# Altium schematic sheet Sheet1.SchDoc
size A4; SheetNumber: 1; SheetTotal: 3
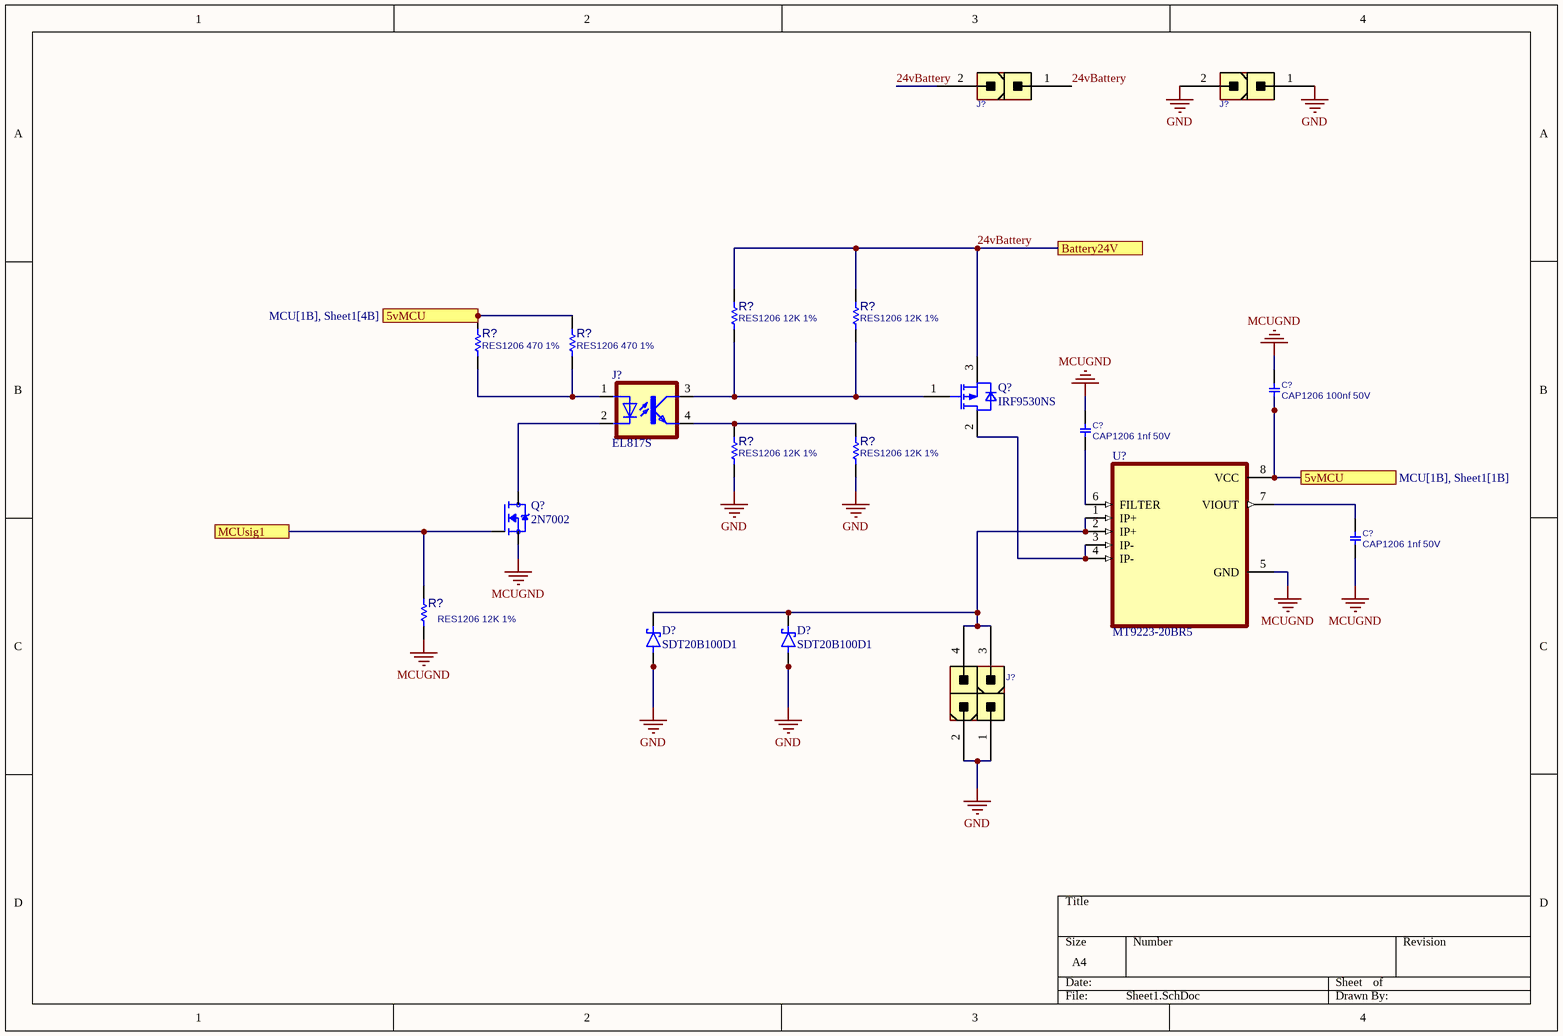
[diagram p0: Sheet1.SchDoc]

## Parts
(Parts that share a designator on the sheet are numbered #1, #2 ... from top to bottom, then left to right.)
C?#1  CAP1206 100nf 50V  [C1206]
C?#2  CAP1206 1nf 50V  [C1206]
C?#3  CAP1206 1nf 50V  [C1206]
D?#1  SDT20B100D1  [DPAK229P990X238-3N]
D?#2  SDT20B100D1  [DPAK229P990X238-3N]
J?#1  CONN_ATXPWR_2  [ATXPWR_2]  (value not drawn)
J?#2  CONN_ATXPWR_2  [ATXPWR_2]  (value not drawn)
J?#3  EL817S  [SOIC254P1030X460-4N]
J?#4  CONN_ATXPWR_4  [ATXPWR_4]  (value not drawn)
Q?#1  IRF9530NS  [TO254P1528X508-4_3N-V1]
Q?#2  2N7002  [SOT95P240X111-3N]
R?#1  RES1206 12K 1%  [R1206]
R?#2  RES1206 12K 1%  [R1206]
R?#3  RES1206 470 1%  [R1206]
R?#4  RES1206 470 1%  [R1206]
R?#5  RES1206 12K 1%  [R1206]
R?#6  RES1206 12K 1%  [R1206]
R?#7  RES1206 12K 1%  [R1206]
U?  MT9223-20BR5  [SOIC127P600X175-8N]

## Ports
5vMCU (see MCU[1B], Sheet1[1B]), 5vMCU (see MCU[1B], Sheet1[4B]), Battery24V, MCUsig1

## Nets
GND: D?#1.1(A) D?#1.3(A__1) D?#2.1(A) D?#2.3(A__1) J?#2.1 J?#2.2 J?#4.1 J?#4.2 R?#5.2 R?#6.2
MCUGND: C?#1.1 C?#2.2 C?#3.2 Q?#2.2(S) R?#7.2 U?.5(GND)
5vMCU: C?#1.2 R?#3.2 R?#4.2 U?.8(VCC) ; port 5vMCU
24vBattery: J?#1.1 J?#1.2 Q?#1.3(SOURCE) R?#1.1 R?#2.1 ; port Battery24V
MCUsig1: Q?#2.1(G) R?#7.1 ; port MCUsig1
NetC?#2_1: C?#2.1 U?.6(FILTER)
NetC?#3_1: C?#3.1 U?.7(VIOUT)
NetD?#1_4: D?#1.4(K) D?#2.4(K) J?#4.3 J?#4.4 U?.1(IP+) U?.2(IP+)
NetJ?#3_1: J?#3.1(A) R?#3.1 R?#4.1
NetJ?#3_2: J?#3.2(C) Q?#2.3(D)
NetJ?#3_3: J?#3.3(COL) Q?#1.1(GATE) R?#1.2 R?#2.2
NetJ?#3_4: J?#3.4(EMIT) R?#5.1 R?#6.1
NetQ?#1_2: Q?#1.2(DRAIN) U?.3(IP-) U?.4(IP-)

## Library data of the parts
C?#1-C?#3 = CAP_SMD_MLCC_1206: CAP, MLCC; PARAM: -, -%; MANF_P#: MANF_PART#; PARAM2: -V; PRICE: 100= 1$; MANF: -; ASSEMBLY: ASSEMBLY
D?#1 D?#2 = MBRD835L: Diode Schottky 35 V 8A Surface Mount DPAK; MF: ON Semiconductor; SnapEDA_Link: https://www.snapeda.com/parts/MBRD835L/Onsemi/view-part/?ref=snap; Package: TO-252-3 MICROSS/On Semiconductor; Value: *; MP: MBRD835L; Check_prices: https://www.snapeda.com/parts/MBRD835L/Onsemi/view-part/?ref=eda
J?#1 J?#2 = CONN_ATXPWR_2: CONN, ATX POWER, 2 P; MANF: Molex; MANF_P#: 39281023; VALUE: CONN_ATXPWR_2; MountType: THD; PACKAGE: ATXPWR-2pin; Part Type: Conn.
J?#3 = EL817S: Optoisolator Transistor Output 5000Vrms 1 Channel 4-SMD; MF: Everlight Electronics; SnapEDA_Link: https://www.snapeda.com/parts/EL817S/Everlight+Electronics+Co+Ltd/view-part/?ref=snap; Package: SMD-4 Everlight Electronics Co Ltd; Value: *; MP: EL817S; Check_prices: https://www.snapeda.com/parts/EL817S/Everlight+Electronics+Co+Ltd/view-part/?ref=eda
J?#4 = CONN_ATXPWR_4: CONN, ATX POWER, 4 P; MANF: TE, Molex; MANF_P#: 4-1775099-0, 39281043; VALUE: CONN_ATXPWR_4; MountType: THD; PACKAGE: ATXPWR-4pin; Part Type: Conn.
Q?#1 = IRF9530NS: OptiMOS - P2 Power-Transistor, P-channel-Enhancement mode, VDS -30V; Manufacturer: Infineon Technologies; Manufacturer Order NumberManufacturer Order Number: IRF9530NS; PackageReference: PG-TO263-3-901
Q?#2 = 2N7002: N-Channel 60V 280mA (Ta) 350mW (Ta) Surface Mount SOT-23-3 (TO-236); MF: {'manufacturer': u'onsemi'}; Package: None; Price: None; Value: *; MP: 2N7002; Availability: Unavailable
R?#1-R?#7 = RES_SMD_1206: RESISTOR, SMD; PARAM: 1%, 0.25W; DESC: DESCRIPTION; DIST#: MOUSER; MANF_P#: -; MANF: -; ASSEMBLY: ASSEMBLY; PRICE: -; PARAM2: -
U? = ACS712ELCTR-05B-T: MF: {'manufacturer': u'Allegro MicroSystems'}; Package: None; Price: None; Value: *; MP: ACS712ELCTR-05B-T; Availability: Unavailable